# EAGLE design brain (EAGLE 6.4)
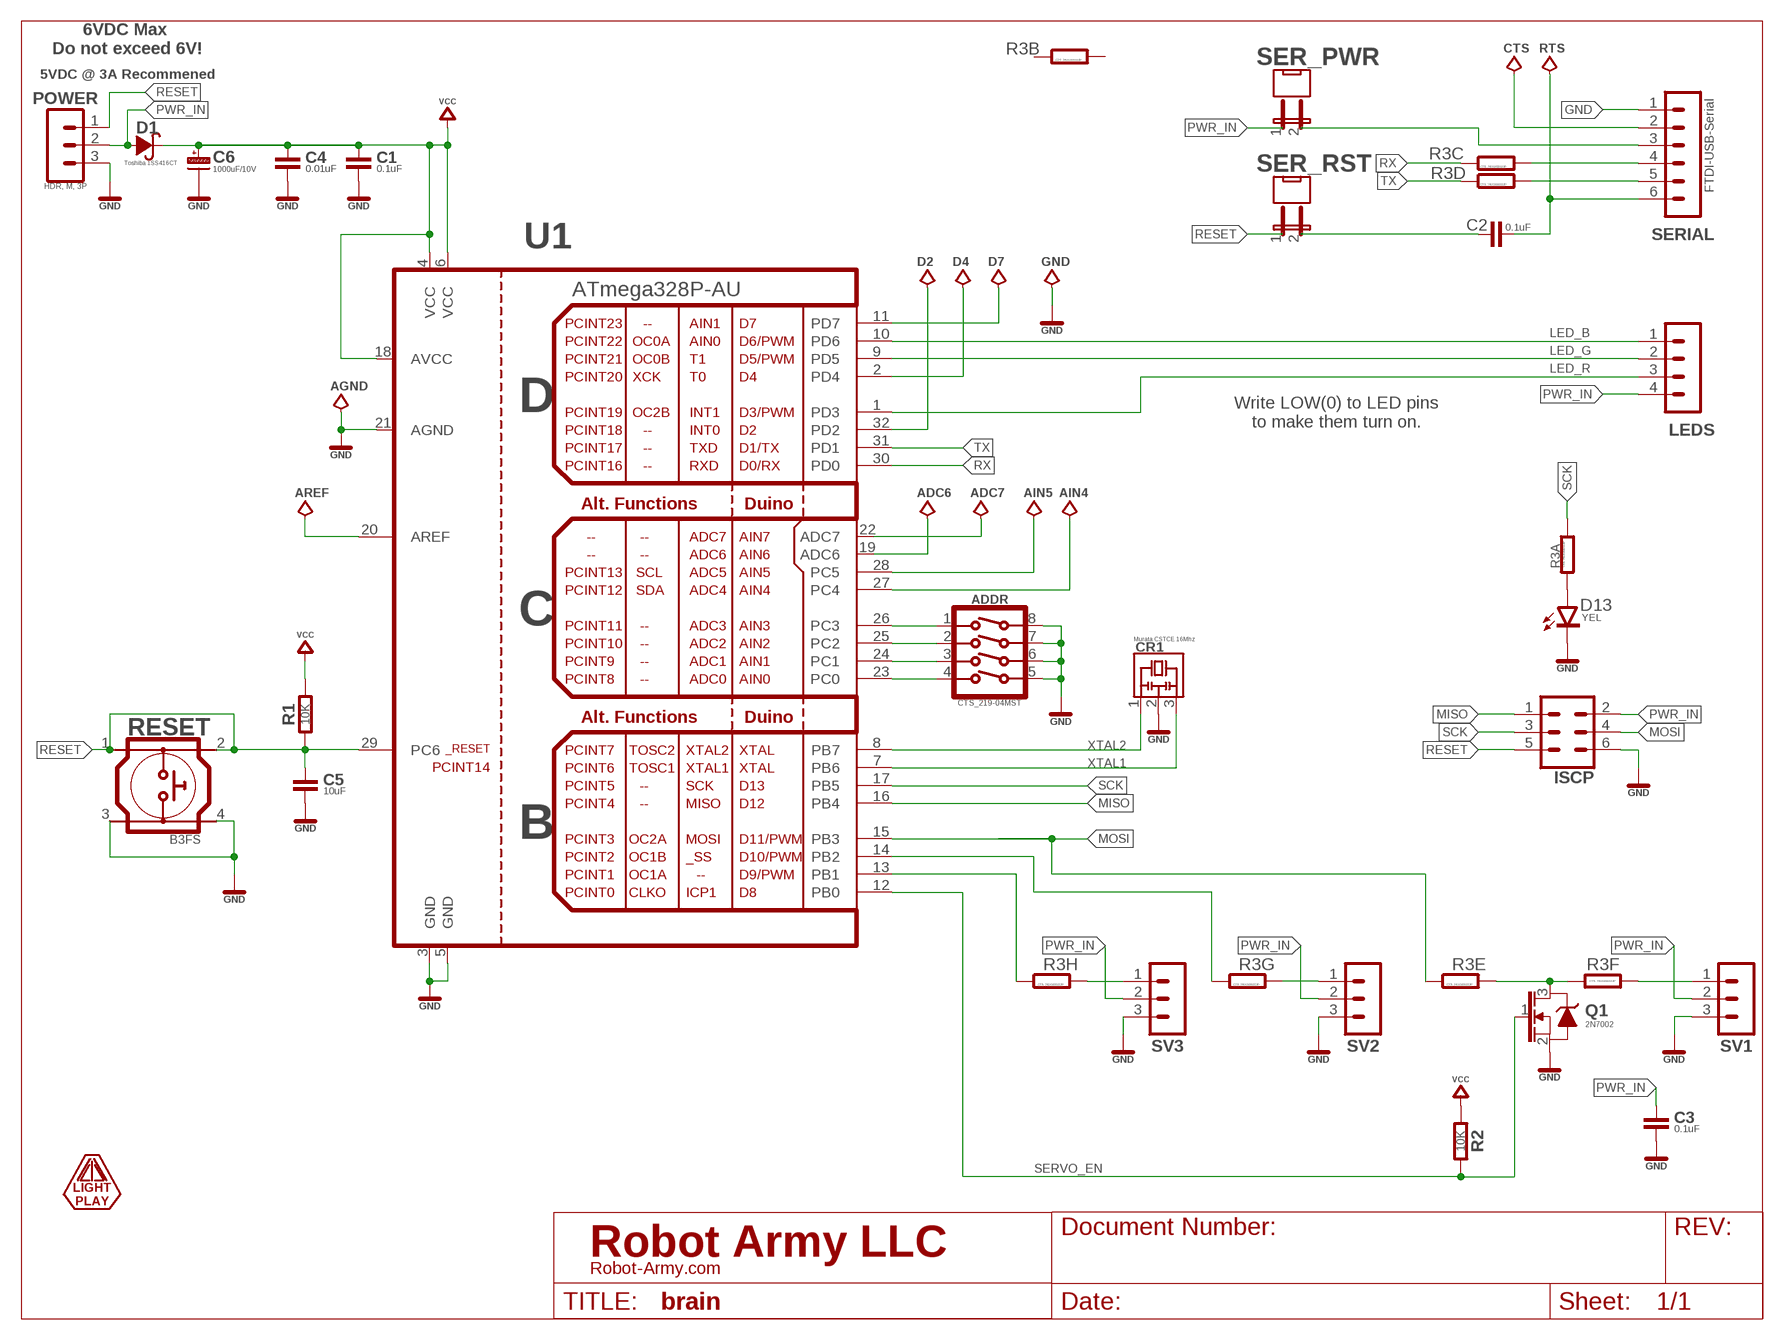
[diagram p0: schematic, sheet 1]
FRAME1 (LETTER_L-LIGHTPLAY): DOCUMENT_NUMBER: LP-BRAIN-01; REV: E

## Parts
ADC6  TEST_POINT_SM_2X2  [TP-SMT-020X020]
ADC7  TEST_POINT_SM_2X2  [TP-SMT-020X020]
ADDR  CTS_219-04MST  DIP-4PCTS-219-SMD  [CTS_4P_GULLWING]
AGND  TEST_POINT_SM_2X2  [TP-SMT-020X020]
AIN4  TEST_POINT_SM_2X2  [TP-SMT-020X020]
AIN5  TEST_POINT_SM_2X2  [TP-SMT-020X020]
AREF  TEST_POINT_SM_2X2  [TP-SMT-020X020]
C1  0.1uF  CAPACITOR0603  [0603]
C2  0.1uF  CAPACITOR0603  [0603]
C3  0.1uF  CAPACITOR0603  [0603]
C4  0.01uF  CAPACITOR0603  [0603]
C5  10uF  CAPACITOR0805  [0805]
C6  1000uF/10V  CAPACITOR_POLCAP_ALUM_THD_8  [CAP_ALUM_THD_8]
CR1  Murata CSTCE 16Mhz  RESONATORMURATA-CSTCE  [MURATA_CSTCE]
CTS  TEST_POINT_SM_2X2  [TP-SMT-020X020]
D1  Toshiba 1SS416CT  SCHOTTKYTOSHIBA_CST2  [CST2]
D2  TEST_POINT_SM_2X2  [TP-SMT-020X020]
D4  TEST_POINT_SM_2X2  [TP-SMT-020X020]
D7  TEST_POINT_SM_2X2  [TP-SMT-020X020]
D13  YEL  SMT0603  [SMD_0603]
GND  TEST_POINT_SM_2X2  [TP-SMT-020X020]
ISCP  MA03-2  [MA03-2]
LEDS  MA04-1  [MA04-1]
LOGO2  LIGHT_PLAY_20MM  [LIGHTPLAY_20MM]
POWER  HDR, M, 3P  MA03-1  [MA03-1]
Q1  2N7002  SOT23_2N7002  [SOT-23]
R1  10K  RESISTOR0603  [0603]
R2  10K  RESISTOR0603  [0603]
R3  CTS 741X163102JP  RESNET_0402_INDIV_X8  [RESNET_0402_X8]
RESET  B3FS  PUSHBTN-SP-MOM-4PINB3FS  [B3FS]
RTS  TEST_POINT_SM_2X2  [TP-SMT-020X020]
SER_PWR  JMP01VT  [MA02-1-FAT]
SER_RST  JMP01VT  [MA02-1-FAT]
SERIAL  MA06-1  [MA06-1]
SV1  MA03-1  [MA03-1]
SV2  MA03-1  [MA03-1]
SV3  MA03-1  [MA03-1]
U1  ATmega328P-AU  ATMEGA328  [TQFP-32-08]

## Nets
AREF: AREF.1 U1.20(AREF)
CTS: CTS.1 SERIAL.2
GND [gnd]: ADDR.5 ADDR.6 ADDR.7 ADDR.8 AGND.1 C1.2 C3.2 C4.2 C5.2 C6.N CR1.2 D13.K(C) GND.1 ISCP.6 POWER.3 Q1.2(S) RESET.3 RESET.4 SERIAL.1 SV1.3 SV2.3 SV3.3 U1.3(GND) U1.5(GND) U1.21(AGND)
LED_B: LEDS.1 U1.10(PD6)
LED_G: LEDS.2 U1.9(PD5)
LED_R: LEDS.3 U1.1(PD3)
MISO: ISCP.1 U1.16(PB4)
MOSI: ISCP.4 R3.5 U1.15(PB3)
N$1: D2.1 U1.32(PD2)
N$2: R3.6 SV1.1
N$3: D4.1 U1.2(PD4)
N$4: ADDR.1 U1.26(PC3)
N$5: R3.9 SV3.1
N$6: D7.1 U1.11(PD7)
N$7: ADC6.1 U1.19(ADC6)
N$8: ADC7.1 U1.22(ADC7)
N$9: R3.10 SV2.1
N$10: Q1.3(D) R3.11 R3.12
N$11: AIN5.1 U1.28(PC5)
N$12: AIN4.1 U1.27(PC4)
N$13: C2.1 SER_RST.2
N$17: D13.A R3.16
N$19: R3.7 U1.14(PB2)
N$20: R3.8 U1.13(PB1)
N$21: ADDR.2 U1.25(PC2)
N$22: ADDR.3 U1.24(PC1)
N$23: ADDR.4 U1.23(PC0)
PWR_IN: C3.1 D1.A ISCP.2 LEDS.4 POWER.2 SER_PWR.1 SV1.2 SV2.2 SV3.2
RESET: C5.1 ISCP.5 POWER.1 R1.1 RESET.1 RESET.2 SER_RST.1 U1.29(PC6)
RTS: C2.2 RTS.1 SERIAL.6
RX: R3.3 U1.30(PD0)
RXD: R3.13 SERIAL.5
SCK: ISCP.3 R3.1 U1.17(PB5)
SERVO_EN: Q1.1(G) R2.2 U1.12(PB0)
TX: R3.4 U1.31(PD1)
TXD: R3.14 SERIAL.4
VCC: C1.1 C4.1 C6.P D1.K R1.2 R2.1 U1.4(VCC) U1.6(VCC) U1.18(AVCC)
VCC5: SER_PWR.2 SERIAL.3
XTAL1: CR1.3 U1.7(PB6)
XTAL2: CR1.1 U1.8(PB7)
Unconnected: R3.2 R3.15

## Notes on the sheet
- 6VDC Max 
  Do not exceed 6V!
- 5VDC @ 3A Recommened
- FTDI-USB-Serial
- Write LOW(0) to LED pins
  to make them turn on.

## Library data of the parts
ADC6 ADC7 AGND AIN4 AIN5 AREF CTS D2 D4 D7 GND RTS = test-points:TEST_POINT: Test point
ADDR = switch-smd:DIP-4P: DIP Switch, 4-pin
C1-C5 = rlc:CAPACITOR: Capacitor
C6 = rlc:CAPACITOR_POL: Polarized Capacitor
CR1 = ceramic-resonators:RESONATOR
D1 = diodes:SCHOTTKY: Schottky Diodes
D13 = led:SMT: LED SMT 0603 0805 1206
ISCP = con-headers:MA03-2: PIN HEADER
LEDS = con-headers:MA04-1: PIN HEADER
LOGO2 = logos:LIGHT_PLAY: LIGHT PLAY LOGOS
POWER SV1-SV3 = con-headers:MA03-1: PIN HEADER
Q1 = transistor-fet:SOT23: FET; RDS: 0.05 ohm
R1 R2 = rlc:RESISTOR: Resistor
R3 = rlc:RESNET_0402_INDIV_X8: Resnet - Resitor Network 8 Individual Resistors.; VALUE: CTS 741X163xxxJP
RESET = switch-smd:PUSHBTN-SP-MOM-4PIN: Omron B3S Series Push Button Switch
SER_PWR SER_RST = con-headers:JMP01: Jumper, 1 position (2 pins)
SERIAL = con-headers:MA06-1: PIN HEADER
U1 = atmel-atmega:ATMEGA328

## Net classes
0 default: width 0.152 mm, clearance 0.152 mm
1 power: width 0.406 mm, drill 0.33 mm, clearance 0.152 mm
2 gnd: width 0.203 mm, drill 0.33 mm, clearance 0.152 mm
3 usbvcc: width 0.203 mm, drill 0.33 mm, clearance 0.152 mm
4 aref: width 0.203 mm, drill 0.33 mm, clearance 0.152 mm

## Board
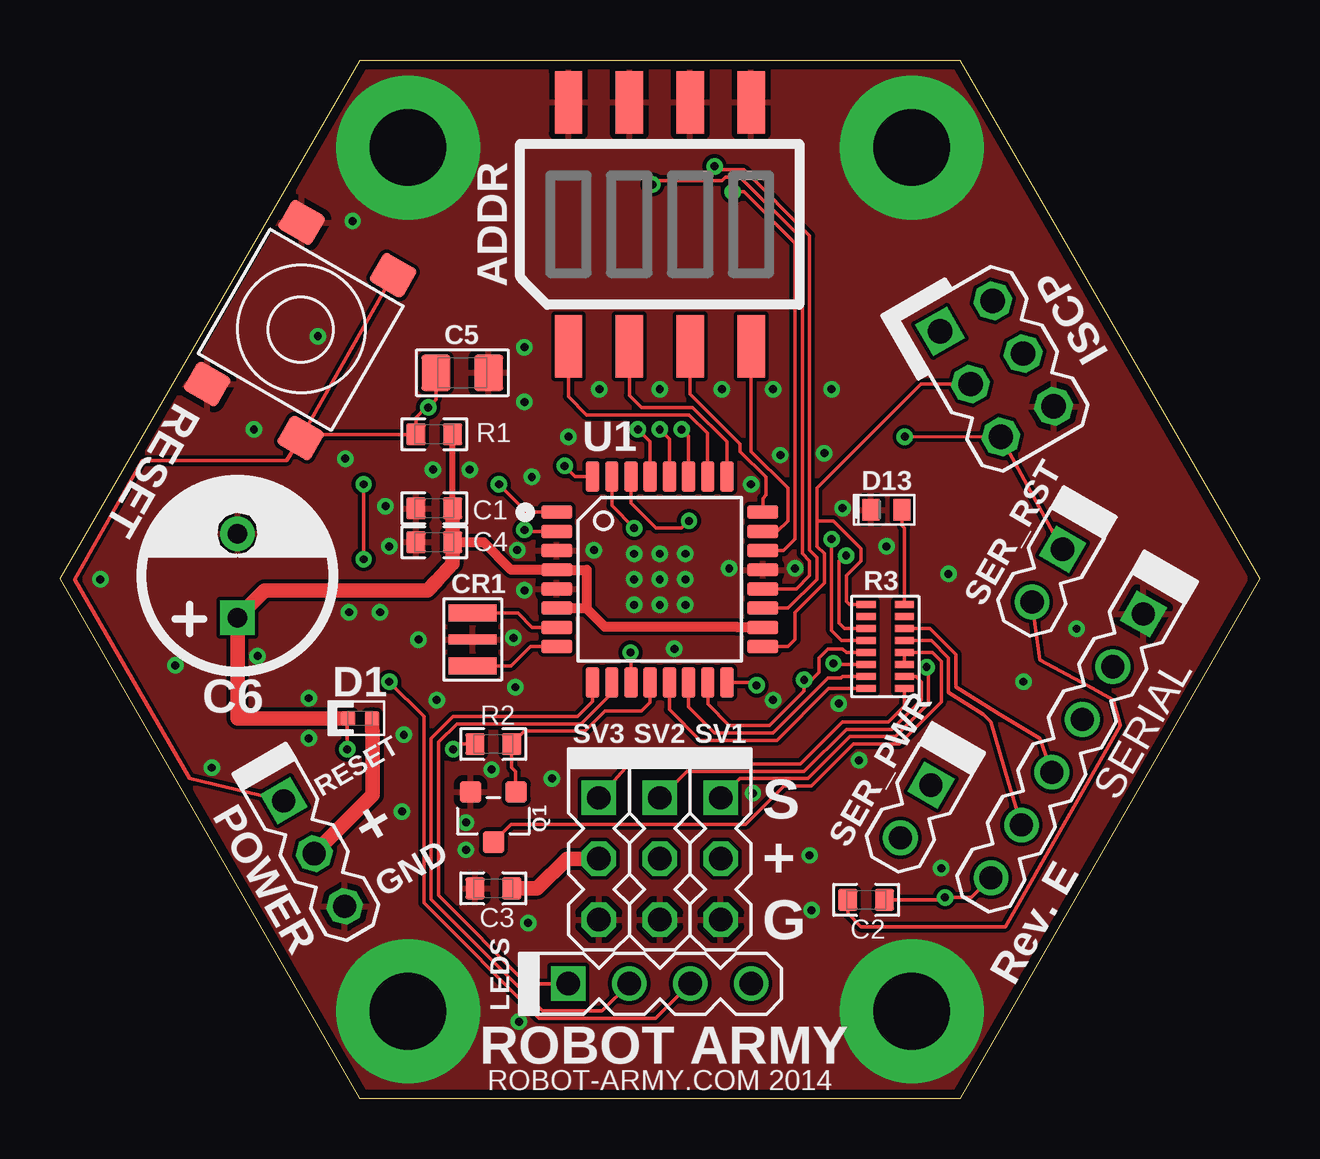
[diagram p1: board, top side]
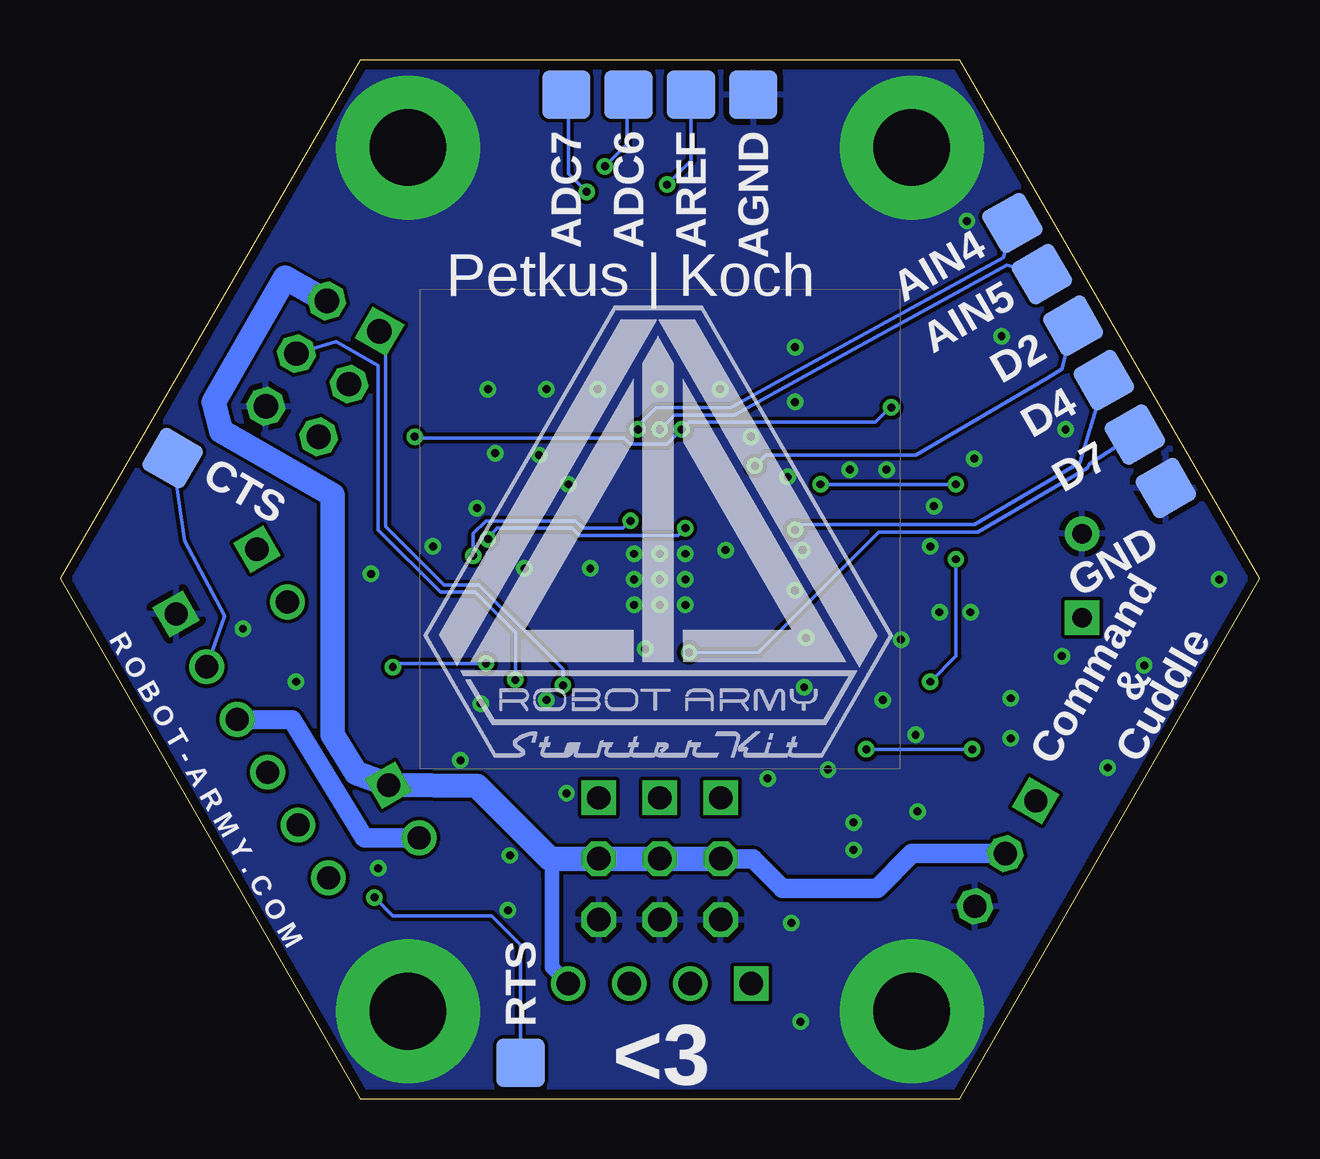
[diagram p2: board, bottom side, seen from below]

Size 50 x 43.3 mm. Coordinates in mm from the lower left corner, seen from the top.
Outline: 12.5,0 0,21.69 12.5,43.3 37.5,43.3 50,21.69 37.5,0 12.5,0
Copper layers (1*16): Top 0.0356mm / dielectric 1.5011mm / Bottom 0.0356mm
Design rules "OSH-CircuitMonkey": minimum track width 6mil, minimum drill 13mil, track to track 6mil, track to pad 6mil, pad to pad 6mil, via to via 6mil, smd to smd 6mil, copper to edge 15mil, drill to drill 6mil, minimum pad ring 7mil, minimum via ring 7mil, stop-mask expansion 3mil, vias tented up to drill 13mil, thermal gap 10mil

### Footprints (pad centres in the part's own frame; a part is rotated, then mirrored left to right if it is on the bottom)
TP-SMT-020X020 = smd 2 x 2: 1 0,0
CTS_4P_GULLWING = smd 1.13 x 2.6: 1 -3.81,-5.08; 2 -1.27,-5.08; 3 1.27,-5.08; 4 3.81,-5.08; 5 3.81,5.08; 6 1.27,5.08; 7 -1.27,5.08; 8 -3.81,5.08
0603 = smd 0.8 x 0.9: 1 -0.763,0; 2 0.763,0
0805 = smd 1.2 x 1.5: 1 -1.1,0; 2 1.1,0
CAP_ALUM_THD_8 = drill 0.8 pad 1.422: N 0,-1.75 | drill 0.8 pad 1.422 square: P 0,1.75
MURATA_CSTCE = smd 0.7 x 2: 1 -1.1,0; 3 1.1,0 | smd 0.4 x 2: 2 0,0
CST2 = smd 0.6 x 0.6: A 0.5,0; K -0.5,0
SMD_0603 = smd 0.7 x 0.9: A 0.65,0; K -0.65,0
MA03-2 = drill 1.016 square: 1 -2.54,-1.27 | drill 1.016 octagon: 2 -2.54,1.27; 3 0,-1.27; 4 0,1.27; 5 2.54,-1.27; 6 2.54,1.27
MA04-1 = drill 0.965 square: 1 -3.81,0 | drill 0.965: 2 -1.27,0; 3 1.27,0; 4 3.81,0
MA03-1 = drill 0.965 square: 1 -2.54,0 | drill 0.965 octagon: 2 0,0; 3 2.54,0
SOT-23 = smd 0.9 x 0.9: 1 -0.95,-1.05; 2 0.95,-1.05; 3 0,1.05
RESNET_0402_X8 = smd 0.8 x 0.28: 1 -0.8,1.75; 2 -0.8,1.25; 3 -0.8,0.75; 4 -0.8,0.25; 5 -0.8,-0.25; 6 -0.8,-0.75; 7 -0.8,-1.25; 8 -0.8,-1.75; 9 0.8,-1.75; 10 0.8,-1.25; 11 0.8,-0.75; 12 0.8,-0.25; 13 0.8,0.25; 14 0.8,0.75; 15 0.8,1.25; 16 0.8,1.75
B3FS = smd 1.4 x 1.6: 1 3.9,-2.2; 2 -3.9,-2.25; 3 3.9,2.2; 4 -3.9,2.25
MA02-1-FAT = drill 0.965 square: 1 -1.27,0 | drill 0.965: 2 1.27,0
MA06-1 = drill 0.965 square: 1 -6.35,0 | drill 0.965: 2 -3.81,0; 3 -1.27,0; 4 1.27,0; 5 3.81,0; 6 6.35,0
TQFP-32-08 = smd 1.27 x 0.559: 1 -4.293,2.8; 2 -4.293,2; 3 -4.293,1.2; 4 -4.293,0.4; 5 -4.293,-0.4; 6 -4.293,-1.2; 7 -4.293,-2; 8 -4.293,-2.8; 17 4.293,-2.8; 18 4.293,-2; 19 4.293,-1.2; 20 4.293,-0.4; 21 4.293,0.4; 22 4.293,1.2; 23 4.293,2; 24 4.293,2.8 | smd 0.559 x 1.27: 9 -2.8,-4.293; 10 -2,-4.293; 11 -1.2,-4.293; 12 -0.4,-4.293; 13 0.4,-4.293; 14 1.2,-4.293; 15 2,-4.293; 16 2.8,-4.293; 25 2.8,4.293; 26 2,4.293; 27 1.2,4.293; 28 0.4,4.293; 29 -0.4,4.293; 30 -1.2,4.293; 31 -2,4.293; 32 -2.8,4.293

### Placement (x,y rotation side)
ADC6  26.3,41.85 270 bottom
ADC7  28.9,41.85 270 bottom
ADDR  25,36.45 0 top
AGND  21.1,41.85 270 bottom
AIN4  10.29,36.51 210 bottom
AIN5  9.07,34.38 210 bottom
AREF  23.7,41.85 270 bottom
C1  15.6,24.61 180 top
C2  33.6,8.29 0 top
C3  18.07,8.77 180 top
C4  15.6,23.2 180 top
C5  16.77,30.26 0 top
C6  7.4,21.8 180 top
CR1  17.2,19.14 90 top
CTS  45.3,26.7 330 bottom
D1  12.5,15.86 0 top
D2  7.77,32.22 210 bottom
D4  6.49,29.95 210 bottom
D7  5.19,27.68 210 bottom
D13  34.45,24.55 0 top
GND  3.9,25.46 210 bottom
ISCP  39.05,30.42 300 top
LEDS  25,4.8 0 top
LOGO2  25,23.75 0 bottom
POWER  10.6,10.22 300 top
Q1  18.07,11.74 180 top
R1  15.6,27.69 0 top
R2  18.07,14.78 0 top
R3  34.4,18.85 0 top
RESET  10.03,32.05 60 top
RTS  30.8,1.5 90 bottom
SER_PWR  35.67,11.97 240 top
SER_RST  41.15,21.8 240 top
SERIAL  41.98,14.71 240 top
SV1  27.54,10.01 270 top
SV2  25,10.01 270 top
SV3  22.46,10.01 270 top
U1  25,21.65 0 top

### Tracks (layer width: path | path; a pad name or v marks a point on that pad's centre or on a via)
AREF  (via drill 0.33)
  Top 0.152: U1.20 30.7,21.25 31.25,21.8 31.25,22.41 30.94,22.72 30.94,35.82 28.35,38.41 27.74,38.41 27.59,38.26 24.85,38.26 v24.7,38.11
  Bottom 0.152: AREF.1 23.7,39.1 v24.7,38.11
CTS
  Bottom 0.152: CTS.1 44.81,23.25 43.14,20.13 SERIAL.2
GND  (via drill 0.33, 3.2 pad 6)
  other vias: 14.5,3.65 35.5,3.65 14.5,39.65 35.5,39.65 19.36,21.19 22.26,22.87 25,21.65 25,22.72 23.93,22.72 23.93,21.65 23.93,20.58 25,20.58 26.07,20.58 26.07,21.65 26.07,22.72 30.64,22.11 19.51,7.32 17.99,13.73 18.98,17.15 15.7,16.62 18.9,19.21 30.03,26.83 27.59,29.57 25,29.57 22.49,29.57 29.72,29.57 31.86,26.91 32.16,29.57 34.45,23.02 37.04,21.88 19.36,29.04 21.19,27.59 19.67,25.92 11.89,26.68 19.06,22.87 28.81,25.61 28.89,12.73 36.73,9.61 31.32,7.86 19.13,3.21 8.24,18.45 1.68,21.65 29.72,16.62 10.75,31.78 13.34,20.28 14.94,19.14 16.92,11.52 27.9,22.11 31.25,10.14 13.72,23.02 13.57,24.7 8.08,27.9 15.55,26.22 17.08,26.22 12.05,20.28 33.31,14.11 20.5,13.34 25.61,18.75 16.92,10.37 40.16,17.38 32.47,16.47 42.37,19.59 12.2,36.59 10.37,16.7 14.33,15.17 10.37,15.02 4.81,18.07 14.26,11.97 6.33,13.8 32.62,24.62 19.36,31.33
  pour Top: 12.5,43.3 37.5,43.3 50,21.65 37.5,0 12.5,0 0,21.75
  pour Bottom: 12.5,43.3 37.5,43.3 50,21.65 37.5,0 12.5,0 0,21.65
LED_B
  Top 0.152: LEDS.1 19.45,4.8 15.78,8.47 15.78,14.87 16.54,15.63 21.72,15.63 23,16.91 U1.10
LED_G
  Top 0.152: U1.9 22.2,16.56 21.57,15.93 16.39,15.93 15.47,15.02 15.47,8.31 20.12,3.67 22.6,3.67 LEDS.2
LED_R  (via drill 0.33)
  Top 0.152: v12.66,22.49 v12.66,25.61 | U1.1 19.46,24.45 v18.29,25.61 | LEDS.3 24.83,3.36 19.97,3.36 15.17,8.16 15.17,15.93 v13.72,17.38
  Bottom 0.152: v13.72,17.38 12.66,18.45 v12.66,22.49 | v18.29,25.61 v12.66,25.61
MISO  (via drill 0.33)
  Top 0.152: U1.16 28.91,17.36 v29.04,17.23
  Bottom 0.152: ISCP.1 36.43,31.78 36.43,23.86 33.99,21.42 32.54,21.42 29.04,17.92 v29.04,17.23
MOSI  (via drill 0.33)
  Top 0.152: U1.15 27,16.45 27.9,15.55 29.57,15.55 31.02,17 v31.02,17.46 31.32,17.46 31.63,17.76 31.63,18.37 32.01,18.75 32.62,18.75 32.77,18.6 R3.5
  Bottom 0.152: v31.02,17.46 31.02,19.44 32.7,21.12 34.14,21.12 36.73,23.71 36.73,30.56 38.49,31.56 ISCP.4
N$1  (via drill 0.33)
  Top 0.152: U1.32 21.47,25.94 v21.04,26.37
  Bottom 0.152: v21.04,26.37 20.58,26.83 14.33,26.83 8.85,30.03 8.24,30.41 D2.1
N$2  (via drill 0.33)
  Top 0.152: R3.6 32.28,18.1 v32.24,18.14 | SV1.1 28.34,13.34 31.17,13.34 32.92,15.1 34.83,15.1 36.2,16.47 36.2,17.92 v36.12,17.99
  Bottom 0.152: v32.24,18.14 35.97,18.14 v36.12,17.99
N$3  (via drill 0.33)
  Top 0.152: U1.2 19.42,23.65 v19.36,23.71
  Bottom 0.152: v19.36,23.71 19.13,23.94 11.89,23.94 7.48,26.52 6.86,28.58 D4.1
N$4
  Top 0.152: ADDR.1 21.19,29.27 21.95,28.51 26.22,28.51 26.98,27.75 26.98,25.96 U1.26
N$5
  Top 0.152: SV3.1 23.71,13.95 30.87,13.95 32.62,15.71 34.52,15.71 35.2,16.38 R3.9
N$6  (via drill 0.33)
  Top 0.152: U1.11 23.8,18.47 v23.78,18.6
  Bottom 0.152: v23.78,18.6 20.88,18.6 15.86,23.63 11.74,23.63 7.17,26.3 7.09,26.45 D7.1
N$7  (via drill 0.33)
  Top 0.152: U1.19 30.35,20.45 31.55,21.65 31.55,22.56 31.25,22.87 31.25,35.98 28.5,38.72 27.44,38.72 v27.29,38.87
  Bottom 0.152: v27.29,38.87 26.37,39.79 26.37,41.78 ADC6.1
N$8  (via drill 0.33)
  Top 0.152: U1.22 30.16,22.85 30.64,23.33 30.64,35.67 28.5,37.8 v28.05,37.8
  Bottom 0.152: v28.05,37.8 28.81,38.57 28.81,41.76 ADC7.1
N$9
  Top 0.152: SV2.1 25.04,12.55 26.14,13.65 31.02,13.65 32.77,15.4 34.68,15.4 35.9,16.62 35.9,17.38 35.68,17.6 R3.10
N$10
  Top 0.152: Q1.3 18.81,11.44 28.57,11.44 30.17,13.04 31.32,13.04 33.08,14.79 34.98,14.79 36.73,16.54 36.73,18.22 36.36,18.6 R3.12 R3.11
N$11  (via drill 0.33)
  Top 0.152: U1.28 25.4,27.5 v25,27.9
  Bottom 0.152: v25,27.9 24.39,28.51 21.88,28.51 18.98,30.11 10.52,34.76 AIN5.1
N$12  (via drill 0.33)
  Top 0.152: U1.27 26.2,27.61 v25.91,27.9
  Bottom 0.152: v25.91,27.9 25.91,28.05 25.15,28.81 22.03,28.81 19.13,30.41 10.67,35.06 AIN4.1
N$13
  Top 0.152: C2.1 32.84,7.72 33.38,7.17 39.4,7.17 44.2,15.55 43.9,16.62 42.83,17.23 40.85,18.3 SER_RST.2
N$17
  Top 0.152: D13.A 35.1,23.9 35.2,23.79 R3.16
N$19
  Top 0.152: U1.14 26.2,16.33 27.29,15.25 29.72,15.25 32.01,17.53 32.54,17.53 32.61,17.6 R3.7
N$20
  Top 0.152: R3.8 32.24,17.1 32.09,17.1 32.03,17.1 29.88,14.94 26.68,14.94 25.4,16.22 U1.13
N$21
  Top 0.152: ADDR.2 23.73,29.32 24.24,28.81 26.37,28.81 27.8,27.38 U1.25
N$22
  Top 0.152: ADDR.3 26.27,29.37 28.35,27.29 28.35,26.98 29.42,25.92 29.42,25.15 29.29,25.03 U1.24
N$23
  Top 0.152: ADDR.4 28.81,26.98 30.33,25.46 30.33,24.09 29.9,23.65 U1.23
PWR_IN
  Top 0.152: C3.1
  Top 0.61: D1.A 13,15.36 13.04,15.32 13.04,12.66 POWER.2 | C3.1 19.89,8.77 21.13,10.01 SV3.2
  Bottom 0.61: 22.45,9.99 SV3.2 | 24.98,9.99 SV2.2 | 28.66,10.01 29.48,10.01 29.5,9.31 29.5,5.48 LEDS.4
  Bottom 0.813: POWER.2 14.48,10.22 15.93,8.77 19.89,8.77 21.11,9.99 22.45,9.99
  Bottom 1.016: 22.45,9.99 24.98,9.99 | SV2.2 SV1.2 28.66,10.01 29.57,9.99 32.62,13.04 SER_PWR.1 37.65,13.57 38.64,15.17 38.64,25.15 43.29,27.82 43.59,29.04 40.62,34.22 ISCP.2
RESET  (via drill 0.33)
  Top 0.152: RESET.1 RESET.2 | RESET.2 10.13,27.69 R1.1 14.84,28.4 15.25,28.81 v15.35,28.81 15.67,29.13 C5.1 | SER_RST.1 ISCP.5 v35.21,27.59 | U1.29 24.6,27.38 v24.09,27.9 | POWER.1 5.42,13.34 0.62,21.65 3.43,26.6 9.46,26.6 RESET.2
  Bottom 0.152: v15.35,28.81 15.4,28.81 16.01,28.2 23.78,28.2 v24.09,27.9 24.7,27.29 26.22,27.29 26.47,27.54 35.08,27.54 v35.21,27.59
RTS  (via drill 0.33)
  Top 0.152: C2.2 36.79,8.29 v36.89,8.39 37.99,8.39 SERIAL.6
  Bottom 0.152: RTS.1 30.8,6.42 32.01,7.63 36.12,7.63 v36.89,8.39
RX  (via drill 0.33)
  Top 0.152: R3.3 32.69,19.6 32.47,19.82 32.47,22.41 v32.77,22.64 | v26.22,24.09 25.91,23.78 24.85,23.78 23.8,24.83 U1.30
  Bottom 0.152: v32.77,22.64 32.77,23.55 32.24,24.09 28.5,24.09 28.2,23.78 26.52,23.78 v26.22,24.09
RXD
  Top 0.152: R3.13 36.31,19.1 37.04,18.37 37.04,16.93 38.49,16.01 38.79,15.71 39.55,13.12 SERIAL.5
SCK
  Top 0.152: U1.17 30.35,18.85 30.64,19.13 30.64,20.28 31.86,21.5 31.86,22.72 31.55,23.02 31.55,24.09 | 31.55,24.09 31.55,25.46 35.88,29.79 ISCP.3 | R3.1 32.91,20.6 32.77,20.74 32.77,21.8 33.38,22.41 33.38,22.95 32.24,24.09 31.55,24.09
SERVO_EN
  Top 0.152: U1.12 24.6,16.53 24.24,16.16 22.71,16.16 21.88,15.32 19.36,15.32 R2.2 18.83,13.8 18.98,13.65 18.98,13.04 19.02,13 Q1.1
TX  (via drill 0.33)
  Top 0.152: R3.4 32.58,19.1 32.16,19.52 v32.16,23.33 | v23.93,23.78 23,24.72 U1.31
  Bottom 0.152: v32.16,23.33 31.78,23.78 28.66,23.78 28.35,23.48 24.24,23.48 v23.93,23.78
TXD
  Top 0.152: R3.14 36.27,19.6 37.34,18.53 37.34,17.15 39.17,16.01 40.85,15.02 SERIAL.4
VCC  (via drill 0.33)
  Top 0.152: R2.1 16.61,14.78 v16.39,14.56 | v11.97,14.56 11.97,15.82 D1.K
  Top 0.254: C1.1 R1.2
  Top 0.406: 21.95,20.45 21.95,22.05 U1.4 18.81,22.05 17.66,23.2 C4.1 | U1.6 21.95,20.45 | U1.18 28.22,19.65 28.2,19.67 22.71,19.67 21.95,20.43 21.95,20.45
  Top 0.61: C1.1 C4.1 16.36,22.31 15.7,21.57 15.32,21.19 8.54,21.19 C6.P 7.4,15.86 D1.K
  Bottom 0.152: v16.39,14.56 v11.97,14.56
VCC5
  Bottom 0.152: 37.31,10.87 37.34,10.91
  Bottom 0.813: SER_PWR.2 37.31,10.87 | 37.34,10.91 40.32,15.78 SERIAL.3
XTAL1
  Top 0.152: U1.7 19.68,19.65 19.09,20.24 CR1.3
XTAL2
  Top 0.152: U1.8 19.61,18.85 18.8,18.04 CR1.1

### Text on the board
tPlace: RESET | S | + | GND | + | G | Rev. E | ROBOT ARMY | ROBOT-ARMY.COM 2014
bPlace: Petkus | Koch | & | Command | Cuddle | R O B O T - A R M Y . C O M | <3